# EAGLE schematic CAN-BUS Shield  v0.9b (EAGLE 7.2.0)
DESCRIPTION: microOBD 200 OBD-II Module; HW_REV: 1.4; PCB_REV: C; PCB_SPEC1: Layer Count: 4; PCB_SPEC2: Size: 1.3" x 0.59"; PCB_SPEC3: Finish Thickness: 0.049" - 0.052"; PCB_SPEC4: Copper Weight: 1oz; TITLE: STM1120
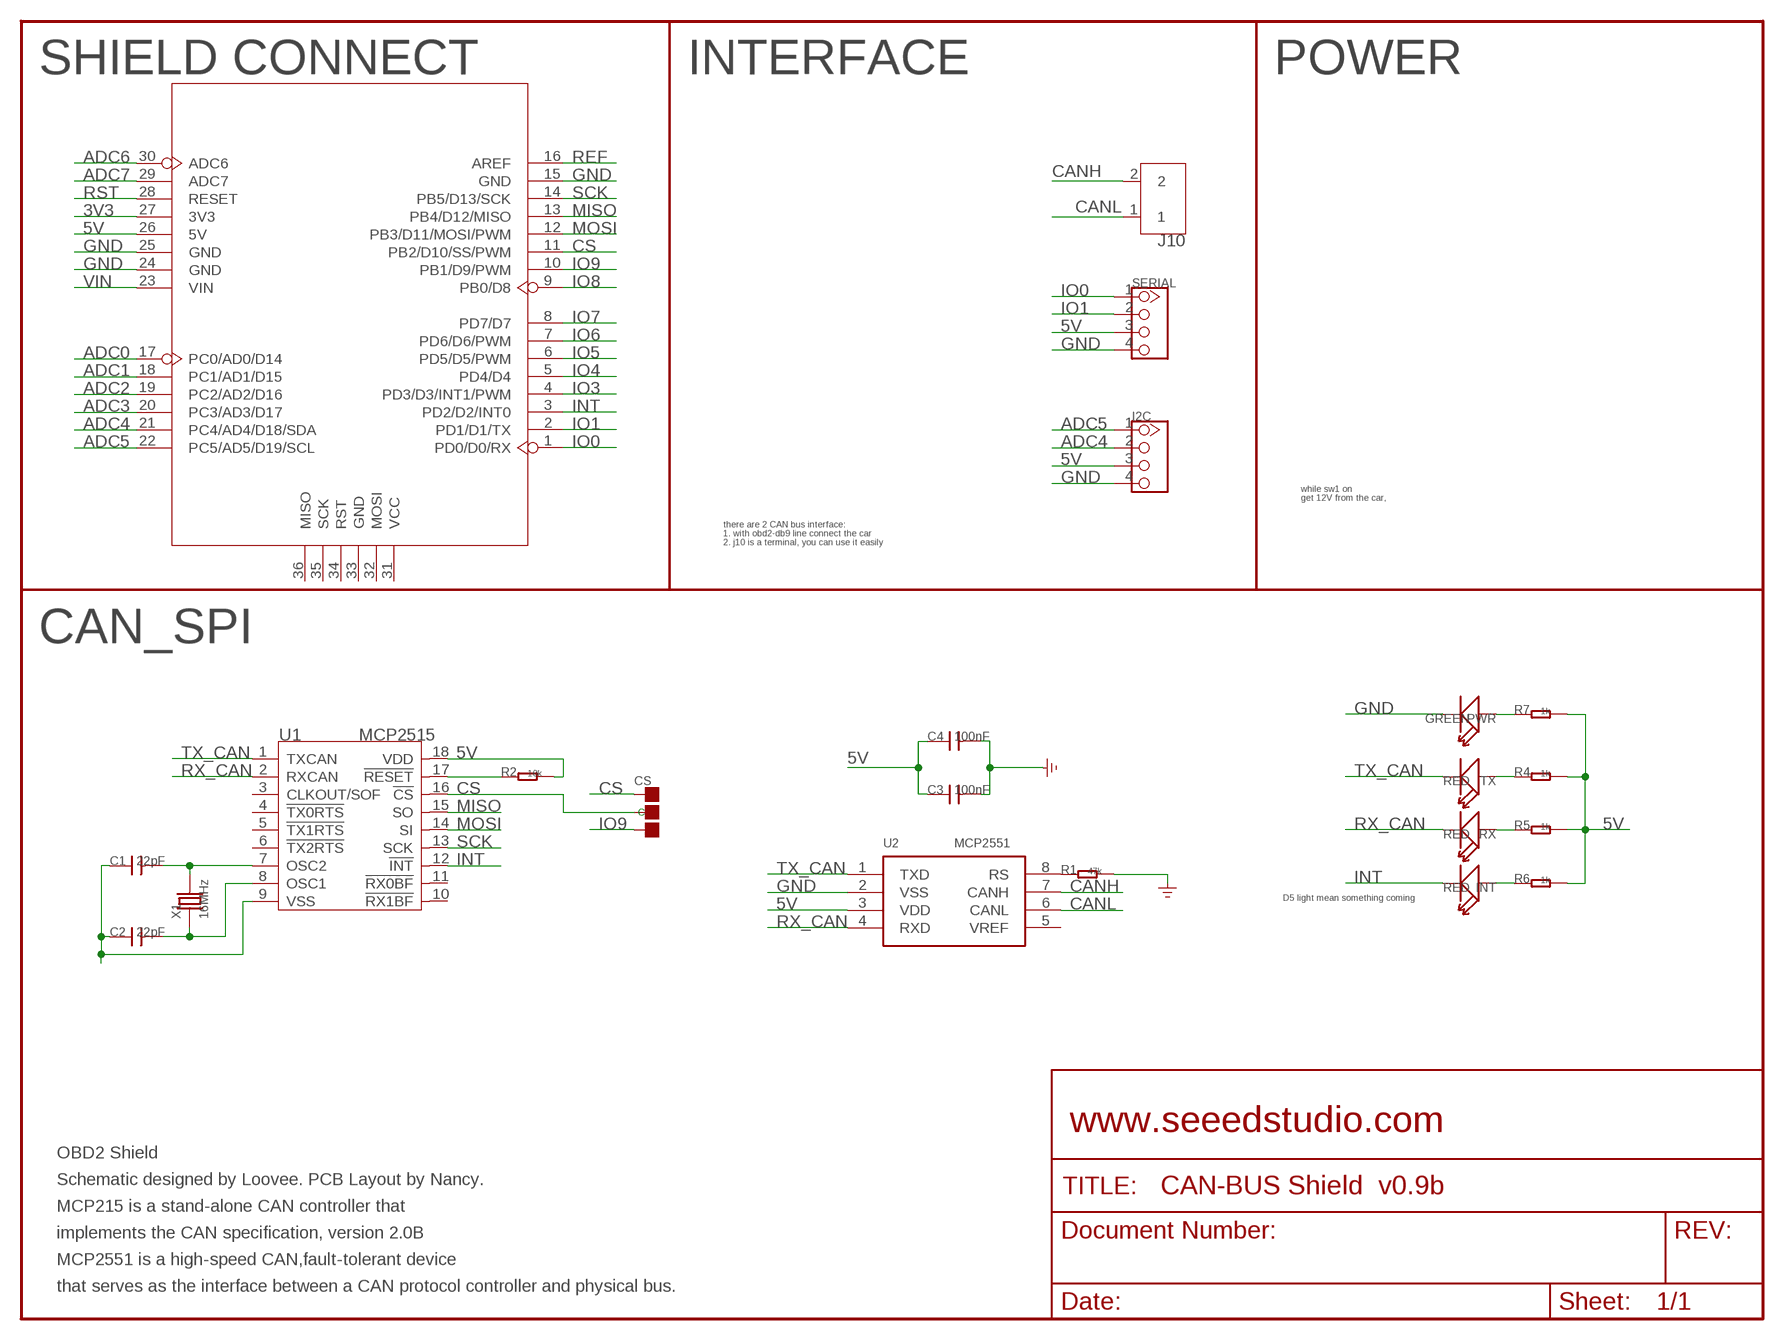
[diagram p0: schematic, sheet 1]

## Parts
C1  22pF  C-0603  [0603]
C2  22pF  C-0603  [0603]
C3  100nF  C-0603  [0603]
C4  100nF  C-0603  [0603]
CS  PAD-JUMPER-3P-40*40  [3P-SMD-4.1X1.5]
I2C  TWIG-4P-2.0-2.0  [4P-2.0]
INT  RED  LED'0603'  [LED-0603]
J10  SCREW-TERMINAL-2P5.0  [2P-5.0]
PWR  GREEN  LED'0603'  [LED-0603]
R1  47k  R-0603  [0603]
R2  10k  R-0603  [0603]
R4  1k  R-0603  [0603]
R5  1k  R-0603  [0603]
R6  1k  R-0603  [0603]
R7  1k  R-0603  [0603]
RX  RED  LED'0603'  [LED-0603]
SERIAL  TWIG-4P-2.0-2.0  [4P-2.0]
TX  RED  LED'0603'  [LED-0603]
U1  MCP2515  [SOIC18]
U2  MCP2551  [SO08]
U3  ARDUINO  [ARDUINO]
X1  16MHz  CRYSTAL-HC49S  [HC49/S]

## Nets
3V3: U3.27(3V3)
5V: C3.1 C4.1 I2C.3 R2.2 R4.2 R5.2 R6.2 R7.2 SERIAL.3 U1.18(VDD) U2.3(VDD) U3.26(5V)
ADC0: U3.17(PC0/AD0/D14)
ADC1: U3.18(PC1/AD1/D15)
ADC2: U3.19(PC2/AD2/D16)
ADC3: U3.20(PC3/AD3/D17)
ADC4: I2C.2 U3.21(PC4/AD4/D18/SDA)
ADC5: I2C.1 U3.22(PC5/AD5/D19/SCL)
ADC6: U3.30(ADC6)
ADC7: U3.29(ADC7)
CANH: J10.2 U2.7(CANH)
CANL: J10.1 U2.6(CANL)
CS: CS.00(L) CS.MM(C) U1.16(!CS) U3.11(PB2/D10/SS/PWM)
GND: C3.2 C4.2 I2C.4 PWR.- R1.2 SERIAL.4 U2.2(VSS) U3.15(GND) U3.24(GND) U3.25(GND)
INT: INT.- U1.12(!INT) U3.3(PD2/D2/INT0)
IO0: SERIAL.1 U3.1(PD0/D0/RX)
IO1: SERIAL.2 U3.2(PD1/D1/TX)
IO3: U3.4(PD3/D3/INT1/PWM)
IO4: U3.5(PD4/D4)
IO5: U3.6(PD5/D5/PWM)
IO6: U3.7(PD6/D6/PWM)
IO7: U3.8(PD7/D7)
IO8: U3.9(PB0/D8)
IO9: CS.11(R) U3.10(PB1/D9/PWM)
MISO: U1.15(SO) U3.13(PB4/D12/MISO)
MOSI: U1.14(SI) U3.12(PB3/D11/MOSI/PWM)
N$1: PWR.+ R7.1
N$2: R4.1 TX.+
N$15: R5.1 RX.+
N$16: C1.2 U1.7(OSC2) X1.2
N$17: C2.2 U1.8(OSC1) X1.1
N$19: INT.+ R6.1
N$20: R1.1 U2.8(RS)
REF: U3.16(AREF)
RST: U3.28(RESET)
RST_N: R2.1 U1.17(!RESET)
RX_CAN: RX.- U1.2(RXCAN) U2.4(RXD)
SCK: U1.13(SCK) U3.14(PB5/D13/SCK)
TX_CAN: TX.- U1.1(TXCAN) U2.1(TXD)
VIN: U3.23(VIN)
VSS: C1.1 C2.1 U1.9(VSS)
Unconnected: U1.3(CLKOUT/SOF) U1.4(!TX0RTS) U1.5(!TX1RTS) U1.6(!TX2RTS) U1.10(!RX1BF) U1.11(!RX0BF) U2.5(VREF) U3.31(VCC) U3.32(MOSI) U3.33(GND) U3.34(RST) U3.35(SCK) U3.36(MISO)

## Notes on the sheet
- SHIELD CONNECT | INTERFACE | POWER
- while sw1 on
- get 12V from the car,
- there are 2 CAN bus interface:
- 1. with obd2-db9 line connect the car
- 2. j10 is a terminal, you can use it easily
- CAN_SPI
- D5 light mean something coming
- www.seeedstudio.com
- OBD2 Shield
- Schematic designed by Loovee. PCB Layout by Nancy.
- MCP215 is a stand-alone CAN controller that
- implements the CAN specification, version 2.0B
- MCP2551 is a high-speed CAN,fault-tolerant device
- that serves as the interface between a CAN protocol controller and physical bus.

## Library data of the parts
C1-C4 = Discrete:C*: Ceramic Capacitors
CS = Discrete:PAD-JUMPER-3P
I2C SERIAL = Connector:TWIG-4P-2.0
INT PWR RX TX = Discrete:LED*
J10 = Connector:SCREW-TERMINAL-2P
R1 R2 R4-R7 = Discrete:R*
U1 = IC:MCP2515: Stand-Alone CAN Controller With SPI Interface
U2 = IC:MCP2551: High-Speed CAN Transceiver http://ww1.microchip.com/downloads/en/devicedoc/21667f.pdf
U3 = Module:ARDUINO
X1 = Discrete:CRYSTAL*: CRYSTAL

## Net classes
0 default: width 0.203 mm, drill 0.305 mm, clearance 0.203 mm